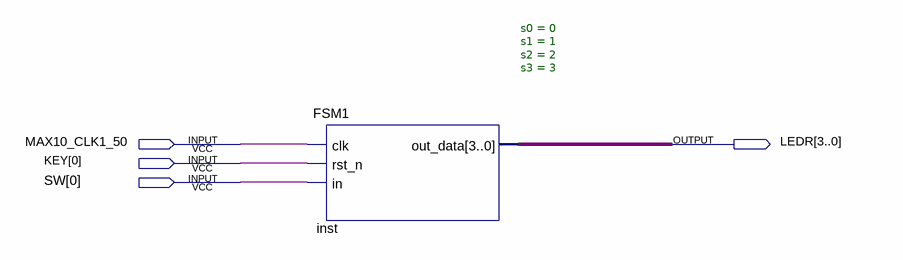
[diagram p0: schematic sheet]
// Quartus schematic Block1.bdf as structural Verilog: 1 symbols, 4 pins
module Block1 (
  input  MAX10_CLK1_50,
  input  [0:0] KEY,
  input  [0:0] SW,
  output [3:0] LEDR
);

  FSM1 #(.s0(0), .s1(1), .s2(2), .s3(3)) inst (.clk(MAX10_CLK1_50), .rst_n(KEY[0]), .in(SW[0]), .out_data(LEDR));
endmodule
